# Altium schematic sheet quick_schematic.SchDoc
size A4; SheetNumber: 1; SheetTotal: 1
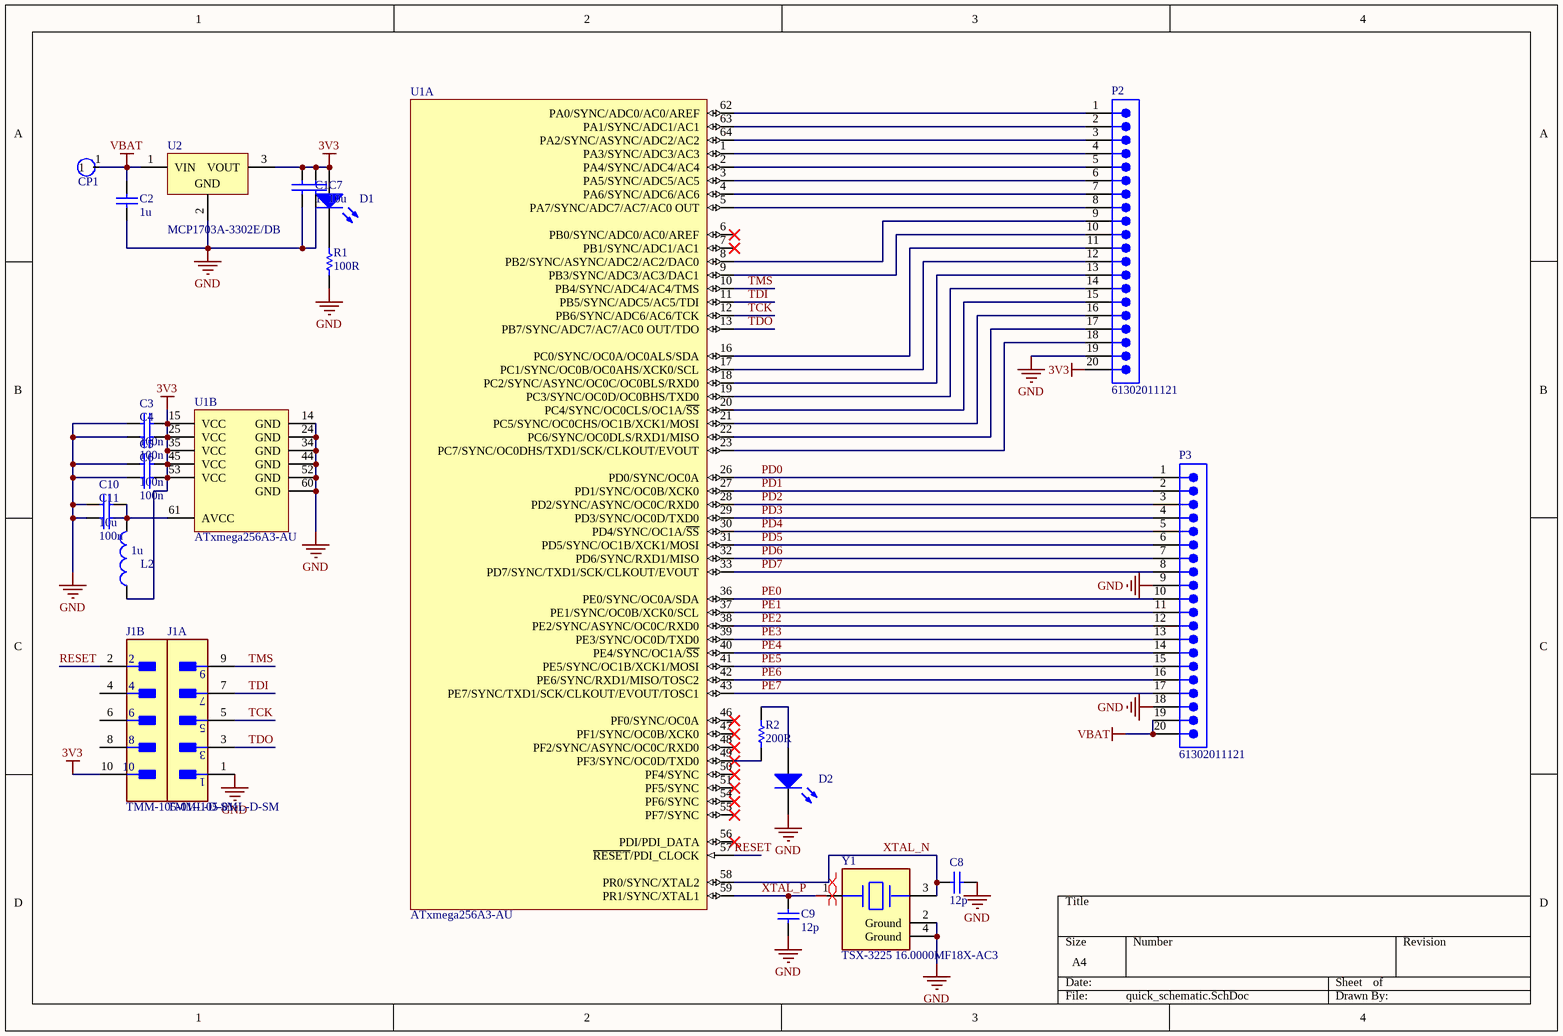
[diagram p0: quick_schematic.SchDoc]

## Parts
C1  value 1u  [SMD-0805-RES]  (hidden comment: Capacitor)
C2  value 1u  [SMD-0805-RES]  (hidden comment: Capacitor)
C3  value 100n  [SMD-0805-RES]  (hidden comment: Capacitor)
C4  value 100n  [SMD-0805-RES]  (hidden comment: Capacitor)
C5  value 100n  [SMD-0805-RES]  (hidden comment: Capacitor)
C6  value 100n  [SMD-0805-RES]  (hidden comment: Capacitor)
C7  value 10u  [SMD-0805-RES]  (hidden comment: Capacitor)
C8  value 12p  [SMD-0805-RES]  (hidden comment: Capacitor)
C9  value 12p  [SMD-0805-RES]  (hidden comment: Capacitor)
C10  value 10u  [SMD-0805-RES]  (hidden comment: Capacitor)
C11  value 100n  [SMD-0805-RES]  (hidden comment: Capacitor)
CP1  CONNECT_PAD  [PAD_SQUARE]  (value not drawn)
D1  Light-Emitting Diode  [SMD-0805-RES]  (value not drawn)
D2  Light-Emitting Diode  [SMD-0805-RES]  (value not drawn)
J1  TMM-105-01-L-D-SM  [FP-TMM-105-01-L-D-SM-MFG]  (parts A,B of 2)
L2  value 1u  [SMD-0805-RES]  (hidden comment: Inductor)
P2  61302011121  [61302011121]
P3  61302011121  [61302011121]
R1  value 100R  [SMD-0805-RES]  (hidden comment: Resistor)
R2  value 200R  [SMD-0805-RES]  (hidden comment: Resistor)
U1  ATxmega256A3-AU  [64A_M]  (parts A,B of 2)
U2  MCP1703A-3302E/DB  [MCHP-SOT-223-DB3_N]
Y1  TSX-3225 16.0000MF18X-AC3  [FP-TSX-3225-MFG]

## Nets
3V3: C1.2 C3.2 C4.2 C5.2 C6.2 C7.2 D1.1(A) J1.10 L2.1 P2.20 U1.15(VCC) U1.25(VCC) U1.35(VCC) U1.45(VCC) U1.53(VCC) U2.3(VOUT)
GND: C1.1 C2.1 C3.1 C4.1 C5.1 C6.1 C7.1 C8.1 C9.2 C10.1 C11.1 D2.2(K) J1.1 P2.19 P3.9 P3.18 R1.2 U1.14(GND) U1.24(GND) U1.34(GND) U1.44(GND) U1.52(GND) U1.60(GND) U2.2(GND) Y1.2(Ground) Y1.4(Ground)
VBAT: C2.2 CP1.1 P3.19 P3.20 U2.1(VIN)
PD0: P3.1 U1.26(PD0/SYNC/OC0A)
PD1: P3.2 U1.27(PD1/SYNC/OC0B/XCK0)
PD2: P3.3 U1.28(PD2/SYNC/ASYNC/OC0C/RXD0)
PD3: P3.4 U1.29(PD3/SYNC/OC0D/TXD0)
PD4: P3.5 U1.30(PD4/SYNC/OC1A/~{SS})
PD5: P3.6 U1.31(PD5/SYNC/OC1B/XCK1/MOSI)
PD6: P3.7 U1.32(PD6/SYNC/RXD1/MISO)
PD7: P3.8 U1.33(PD7/SYNC/TXD1/SCK/CLKOUT/EVOUT)
PE0: P3.10 U1.36(PE0/SYNC/OC0A/SDA)
PE1: P3.11 U1.37(PE1/SYNC/OC0B/XCK0/SCL)
PE2: P3.12 U1.38(PE2/SYNC/ASYNC/OC0C/RXD0)
PE3: P3.13 U1.39(PE3/SYNC/OC0D/TXD0)
PE4: P3.14 U1.40(PE4/SYNC/OC1A/~{SS})
PE5: P3.15 U1.41(PE5/SYNC/OC1B/XCK1/MOSI)
PE6: P3.16 U1.42(PE6/SYNC/RXD1/MISO/TOSC2)
PE7: P3.17 U1.43(PE7/SYNC/TXD1/SCK/CLKOUT/EVOUT/TOSC1)
RESET: J1.2 U1.57(~{RESET}/PDI_CLOCK)
TCK: J1.5 U1.12(PB6/SYNC/ADC6/AC6/TCK)
TDI: J1.7 U1.11(PB5/SYNC/ADC5/AC5/TDI)
TDO: J1.3 U1.13(PB7/SYNC/ADC7/AC7/AC0_OUT/TDO)
TMS: J1.9 U1.10(PB4/SYNC/ADC4/AC4/TMS)
XTAL_N: C8.2 U1.58(PR0/SYNC/XTAL2) Y1.3
XTAL_P: C9.1 U1.59(PR1/SYNC/XTAL1) Y1.1
NetC10_2: C10.2 C11.2 L2.2 U1.61(AVCC)
NetD1_2: D1.2(K) R1.1
NetD2_1: D2.1(A) R2.2
NetP2_1: P2.1 U1.62(PA0/SYNC/ADC0/AC0/AREF)
NetP2_2: P2.2 U1.63(PA1/SYNC/ADC1/AC1)
NetP2_3: P2.3 U1.64(PA2/SYNC/ASYNC/ADC2/AC2)
NetP2_4: P2.4 U1.1(PA3/SYNC/ADC3/AC3)
NetP2_5: P2.5 U1.2(PA4/SYNC/ADC4/AC4)
NetP2_6: P2.6 U1.3(PA5/SYNC/ADC5/AC5)
NetP2_7: P2.7 U1.4(PA6/SYNC/ADC6/AC6)
NetP2_8: P2.8 U1.5(PA7/SYNC/ADC7/AC7/AC0_OUT)
NetP2_9: P2.9 U1.8(PB2/SYNC/ASYNC/ADC2/AC2/DAC0)
NetP2_10: P2.10 U1.9(PB3/SYNC/ADC3/AC3/DAC1)
NetP2_11: P2.11 U1.16(PC0/SYNC/OC0A/OC0ALS/SDA)
NetP2_12: P2.12 U1.17(PC1/SYNC/OC0B/OC0AHS/XCK0/SCL)
NetP2_13: P2.13 U1.18(PC2/SYNC/ASYNC/OC0C/OC0BLS/RXD0)
NetP2_14: P2.14 U1.19(PC3/SYNC/OC0D/OC0BHS/TXD0)
NetP2_15: P2.15 U1.20(PC4/SYNC/OC0CLS/OC1A/~{SS})
NetP2_16: P2.16 U1.21(PC5/SYNC/OC0CHS/OC1B/XCK1/MOSI)
NetP2_17: P2.17 U1.22(PC6/SYNC/OC0DLS/RXD1/MISO)
NetP2_18: P2.18 U1.23(PC7/SYNC/OC0DHS/TXD1/SCK/CLKOUT/EVOUT)
NetR2_1: R2.1 U1.49(PF3/SYNC/OC0D/TXD0)

Not connected (* = marked no-connect by the designer): J1 4 6 8; U1 6(PB0/SYNC/ADC0/AC0/AREF)* 7(PB1/SYNC/ADC1/AC1)* 46(PF0/SYNC/OC0A)* 47(PF1/SYNC/OC0B/XCK0)* 48(PF2/SYNC/ASYNC/OC0C/RXD0)* 50(PF4/SYNC)* 51(PF5/SYNC)* 54(PF6/SYNC)* 55(PF7/SYNC)* 56(PDI/PDI_DATA)*

## Layout directives
differential pair: XTAL_N, XTAL_P

## Library data of the parts
C1-C11 = Capacitor: SimulationGenericComponent: True
D1 D2 = LED: AF: 1; BV: 0; BV_MAX: 1e99; EG: 1.11; FC: 0.5; IBV: 0.001; IS: 1e-14; MJSW: 0.33; NTUN: 30; TNOM: 27; XTI: 3; SimulationGenericComponent: True; CJO: 0; CJP: 0; CTA: 0; CTP: 0; FCS: 0.5; FV_MAX: 1e99; IKF: 0; IKR: 0; ISR: 1e-14; JSW: 0; JTUN: 0; JTUNSW: 0; KEG: 1; KF: 0; LEVEL: 1; N: 1; NBV: 1; NR: 1; NS: 1; PHP: 1; RS: 0; TCV: 0; TLEV: 0; TLEVC: 0; TM1: 0; TM2: 0; TPB: 0; TPHP: 0; TRS: 0; TRS2: 0; TT: 0; TTT1: 0; TTT2: 0; VJ: 1; XTITUN: 3
J1 = CMP-02766-001581-1: CONN HEADER SMD 10POS 2MM; Max Voltage Rating (AC): 500V; Max Current Rating: 3.9A; Number of Positions: 10; Gender: Male; Insulation Color: Black; REACH SVHC: No SVHC; Depth: 3.94mm; Housing Material: Polymer; Packaging: Rail/Tube; Series: TMM; Contact Plating: Gold; Contact Type: Male Pin; Length: 10mm; Pitch: 2mm; Min Operating Temperature: -55°C; Fastening Type: Pull; Max Operating Temperature: 125°C; Flammability Rating: UL94 V-0; Radiation Hardening: No; RoHS Compliant: Yes; Termination: Solder; Housing Color: Black; Number of Rows: 2; Connector Type: Header; Orientation: Straight; Contact Finish - Mating: GOLD; Lead Free: Lead Free; Contact Shape: Square; Insulation Material: Polymer; Contact Material: Bronze; Number of Contacts: 10
L2 = Inductor: SimulationGenericComponent: True
P2 P3 = CMP-1502-01102-2: NexarPartId: 32855554; Number of Contacts: 20; Contact Resistance: 20mΩ; Pitch: 2.54mm; Gender: Male; Operating Supply Voltage: 250V; Connector Type: Male Pin; Current Rating: 3A; Packaging: Bulk; RoHS: Compliant; Contact Material: Copper; Contact Mating Length: 5.9944mm; Number of Positions: 20; Orientation: Vertical; Termination: Solder; Number of Pins: 20; Color: Black; REACH SVHC: Unknown; Mount: Through Hole; Contact Plating: Gold; Number of Rows: 1; Lead Pitch: 2.54mm
R1 R2 = Resistor: TC1: 0; SimulationGenericComponent: True; TC2: 0
U1 = CMP-0094-00038-3: 8/16-bit AVR XMEGA A3 Microcontroller, 1.6-3.6V, 32MHz, 256KB + 8KB Flash, 4KB EEPROM, 16KB SRAM, 64-pin TQFP, Industrial Grade (-40°C to 85°C), Pb-Free; Manufacturer: Atmel; ComponentLink2URL: http://www.atmel.com/Images/Atmel-8068-8-and16-bit-AVR-XMEGA-A3-Microcontrollers_Datasheet.pdf; PackageDescription: 64-Pin Plastic Thin Profile Quad Flat Pack, 14 x 14 x 1.0 mm Body, 0.8 mm Pitch (TQFP); DatasheetVersion: revU, Jun-2013; Code_JEDEC: MS-026-AEB; ComponentLink2Description: Datasheet; RevisionNote: datasheet versionæ›´æ–°ï¼ŒPartAä¸Šä¸‹ç¼©çŸ­10,ç®¡è„šåå¤–éœ²æ”¾å®½20,pin20 40 SSåŠ bar, PartB GNDæŒ‰é¡ºåºæŽ’åˆ—; PackageVersion: revC, Oct-2010; ComponentLink1URL: http://www.atmel.com/; PartNumber: ATxmega256A3-AU; ComponentLink1Description: Manufacturer URL; PackageReference: 64A
U2 = CMP-0136-01118-1: 250 mA, 16 V, Low Quiescent Current LDO Regulator, -40 to 125 degC, 3-pin SOT-223 (DB3), Tube; Manufacturer: Microchip; ComponentLink3Description: Package Specification; PackageVersion: C04-032B; ComponentLink1URL: http://www.microchip.com; PartNumber: MCP1703A-3302E/DB; ComponentLink4URL: http://www.microchip.com/MCP1703A; PackageDescription: 3-Lead Plastic Small Outline Transistor, 6.5 x 3.5 mm Body, 2.3 mm Pitch; PackageReference: SOT-223-DB3; DatasheetVersion: Rev. A; Mounting Technology: Surface Mount; ComponentLink4Description: Product URL; ComponentLink2Description: Datasheet; ComponentLink1Description: Manufacturer URL; ComponentLink3URL: http://www.microchip.com/stellent/groups/techpub_sg/documents/packagingspec/en012702.pdf; ComponentLink2URL: http://ww1.microchip.com/downloads/en/DeviceDoc/25122A.pdf
Y1 = CMP-2000-07332-2: CRYSTAL 16.0000MHZ 9PF SMD; Frequency: 16MHz; Drive Level: 200uW; Frequency Stability: 18ppm; Frequency Tolerance: 10ppm; ESR (Equivalent Series Resistance): 60R; RoHS Compliant: Yes; Weight: 0.000564oz; Series: TSX-3225; Packaging: Tape and Reel; Mount: Surface Mount; Min Operating Temperature: -40°C; Case/Package: SMD/SMT; Width: 0.098inch; Length: 0.126inch; Load Capacitance: 9pF; Lead Free: Lead Free; Termination: SMD/SMT; Max Operating Temperature: 85°C; Package Quantity: 250; Tolerance: 10ppm; Height: 0.024inch